# EAGLE schematic backplane-manual selection (EAGLE 6.6.0)
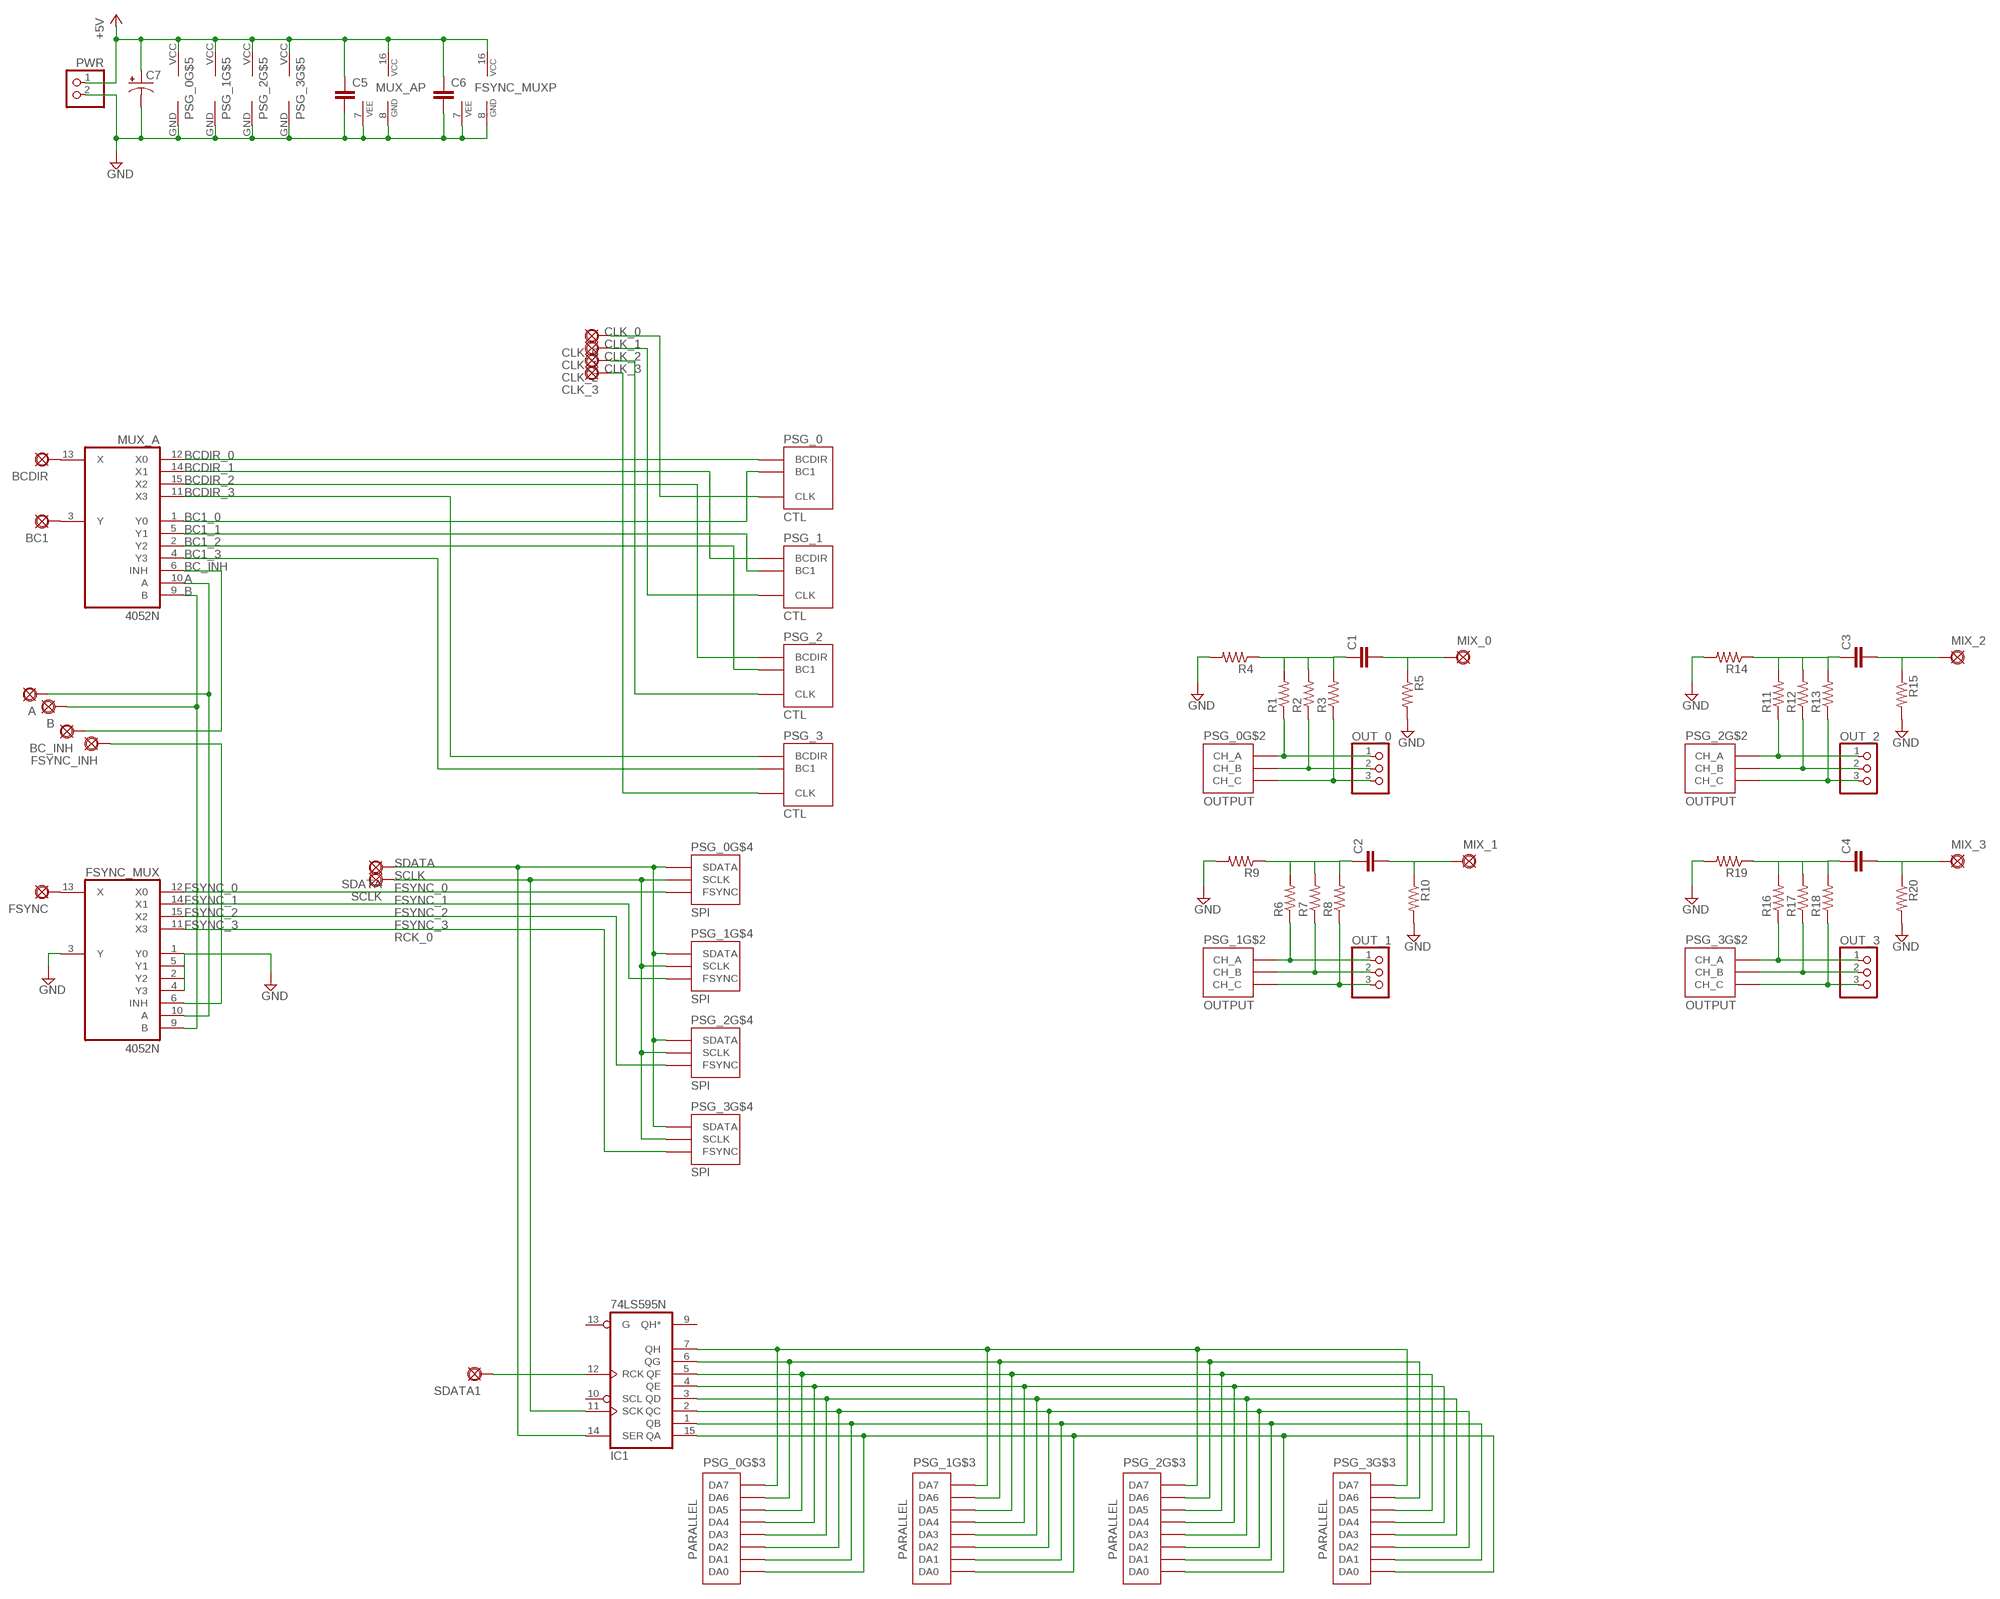
[diagram p0: schematic, sheet 1]

## Parts
A  PAD  [SQUARE]
B  PAD  [SQUARE]
BC1  PAD  [SQUARE]
BC_INH  PAD  [SQUARE]
BCDIR  PAD  [SQUARE]
C1  080X0452  [080X045]
C2  080X0452  [080X045]
C3  080X0452  [080X045]
C4  080X0452  [080X045]
C5  050X030_0251  [050X030_025]
C6  050X030_0251  [050X030_025]
C7  0631  [063_025]
CLK_0  PAD  [SQUARE]
CLK_1  PAD  [SQUARE]
CLK_2  PAD  [SQUARE]
CLK_3  PAD  [SQUARE]
FSYNC  PAD  [SQUARE]
FSYNC_INH  PAD  [SQUARE]
FSYNC_MUX  4052N  [DIL16]
IC1  74LS595N  [DIL16]
MIX_0  PAD  [SQUARE]
MIX_1  PAD  [SQUARE]
MIX_2  PAD  [SQUARE]
MIX_3  PAD  [SQUARE]
MUX_A  4052N  [DIL16]
OUT_0  PINHD-1X3  [1X03]
OUT_1  PINHD-1X3  [1X03]
OUT_2  PINHD-1X3  [1X03]
OUT_3  PINHD-1X3  [1X03]
PSG_0  PSG_DAUGHTER  [PSG_DAUGHTER]
PSG_1  PSG_DAUGHTER  [PSG_DAUGHTER]
PSG_2  PSG_DAUGHTER  [PSG_DAUGHTER]
PSG_3  PSG_DAUGHTER  [PSG_DAUGHTER]
PWR  PINHD-1X2  [1X02]
R1  6MM.3  [R0207/3]
R2  6MM.3  [R0207/3]
R3  6MM.3  [R0207/3]
R4  6MM.3  [R0207/3]
R5  6MM.3  [R0207/3]
R6  6MM.3  [R0207/3]
R7  6MM.3  [R0207/3]
R8  6MM.3  [R0207/3]
R9  6MM.3  [R0207/3]
R10  6MM.3  [R0207/3]
R11  6MM.3  [R0207/3]
R12  6MM.3  [R0207/3]
R13  6MM.3  [R0207/3]
R14  6MM.3  [R0207/3]
R15  6MM.3  [R0207/3]
R16  6MM.3  [R0207/3]
R17  6MM.3  [R0207/3]
R18  6MM.3  [R0207/3]
R19  6MM.3  [R0207/3]
R20  6MM.3  [R0207/3]
SCLK  PAD  [SQUARE]
SDATA  PAD  [SQUARE]
SDATA1  PAD  [SQUARE]

## Nets
+5V: C5.1 C6.1 C7.+ FSYNC_MUX.16(VCC) MUX_A.16(VCC) PSG_0.VCC PSG_1.VCC PSG_2.VCC PSG_3.VCC PWR.1
A: A.1(PAD) FSYNC_MUX.10(A) MUX_A.10(A)
B: B.1(PAD) FSYNC_MUX.9(B) MUX_A.9(B)
BC1_0: MUX_A.1(Y0) PSG_0.BC1
BC1_1: MUX_A.5(Y1) PSG_1.BC1
BC1_2: MUX_A.2(Y2) PSG_2.BC1
BC1_3: MUX_A.4(Y3) PSG_3.BC1
BC_INH: BC_INH.1(PAD) MUX_A.6(INH)
BCDIR_0: MUX_A.12(X0) PSG_0.BCDIR
BCDIR_1: MUX_A.14(X1) PSG_1.BCDIR
BCDIR_2: MUX_A.15(X2) PSG_2.BCDIR
BCDIR_3: MUX_A.11(X3) PSG_3.BCDIR
CLK_0: CLK_0.1(PAD) PSG_0.CLK
CLK_1: CLK_1.1(PAD) PSG_1.CLK
CLK_2: CLK_2.1(PAD) PSG_2.CLK
CLK_3: CLK_3.1(PAD) PSG_3.CLK
FSYNC: FSYNC.1(PAD) FSYNC_MUX.13(X)
FSYNC_0: FSYNC_MUX.12(X0) PSG_0.FSYNC
FSYNC_1: FSYNC_MUX.14(X1) PSG_1.FSYNC
FSYNC_2: FSYNC_MUX.15(X2) PSG_2.FSYNC
FSYNC_3: FSYNC_MUX.11(X3) PSG_3.FSYNC
FSYNC_INH: FSYNC_INH.1(PAD) FSYNC_MUX.6(INH)
GND: C5.2 C6.2 C7.- FSYNC_MUX.1(Y0) FSYNC_MUX.2(Y2) FSYNC_MUX.3(Y) FSYNC_MUX.4(Y3) FSYNC_MUX.5(Y1) FSYNC_MUX.7(VEE) FSYNC_MUX.8(GND) MUX_A.7(VEE) MUX_A.8(GND) PSG_0.GND PSG_1.GND PSG_2.GND PSG_3.GND PWR.2 R4.2 R5.2 R9.2 R10.2 R14.2 R15.2 R19.2 R20.2
N$1: C1.1 R1.2 R2.2 R3.2 R4.1
N$2: BCDIR.1(PAD) MUX_A.13(X)
N$3: BC1.1(PAD) MUX_A.3(Y)
N$5: C1.2 MIX_0.1(PAD) R5.1
N$8: C2.1 R6.2 R7.2 R8.2 R9.1
N$9: C2.2 MIX_1.1(PAD) R10.1
N$13: C3.1 R11.2 R12.2 R13.2 R14.1
N$14: C3.2 MIX_2.1(PAD) R15.1
N$16: IC1.7(QH) PSG_0.DA7 PSG_1.DA7 PSG_2.DA7 PSG_3.DA7
N$17: IC1.15(QA) PSG_0.DA0 PSG_1.DA0 PSG_2.DA0 PSG_3.DA0
N$18: IC1.1(QB) PSG_0.DA1 PSG_1.DA1 PSG_2.DA1 PSG_3.DA1
N$19: IC1.2(QC) PSG_0.DA2 PSG_1.DA2 PSG_2.DA2 PSG_3.DA2
N$20: IC1.3(QD) PSG_0.DA3 PSG_1.DA3 PSG_2.DA3 PSG_3.DA3
N$21: IC1.4(QE) PSG_0.DA4 PSG_1.DA4 PSG_2.DA4 PSG_3.DA4
N$22: IC1.5(QF) PSG_0.DA5 PSG_1.DA5 PSG_2.DA5 PSG_3.DA5
N$23: IC1.6(QG) PSG_0.DA6 PSG_1.DA6 PSG_2.DA6 PSG_3.DA6
N$24: OUT_0.1 PSG_0.OUT_A(CH_A) R1.1
N$25: OUT_0.2 PSG_0.OUT_B(CH_B) R2.1
N$26: OUT_0.3 PSG_0.OUT_C(CH_C) R3.1
N$27: OUT_1.1 PSG_1.OUT_A(CH_A) R6.1
N$28: OUT_1.2 PSG_1.OUT_B(CH_B) R7.1
N$29: OUT_1.3 PSG_1.OUT_C(CH_C) R8.1
N$30: OUT_2.1 PSG_2.OUT_A(CH_A) R11.1
N$31: OUT_2.2 PSG_2.OUT_B(CH_B) R12.1
N$32: OUT_2.3 PSG_2.OUT_C(CH_C) R13.1
N$33: OUT_3.1 PSG_3.OUT_A(CH_A) R16.1
N$34: OUT_3.2 PSG_3.OUT_B(CH_B) R17.1
N$35: OUT_3.3 PSG_3.OUT_C(CH_C) R18.1
N$38: C4.1 R16.2 R17.2 R18.2 R19.1
N$39: C4.2 MIX_3.1(PAD) R20.1
RCK_0: IC1.12(RCK) SDATA1.1(PAD)
SCLK: IC1.11(SCK) PSG_0.SCLK PSG_1.SCLK PSG_2.SCLK PSG_3.SCLK SCLK.1(PAD)
SDATA: IC1.14(SER) PSG_0.SDATA PSG_1.SDATA PSG_2.SDATA PSG_3.SDATA SDATA.1(PAD)
Unconnected: IC1.9(QH*) IC1.10(SCL) IC1.13(G)

## Power pins joined to a net without a drawn wire
GND: IC1.8(GND)
VCC: IC1.16(VCC)

## Library data of the parts
A B BC1 BC_INH BCDIR CLK_0 CLK_1-CLK_3 FSYNC FSYNC_INH MIX_0 MIX_1-MIX_3 SCLK SDATA SDATA1 = gm-supply:PAD: PAD use this package for pads with any purpose, including input, output, send or return various pad shapes: round, square, octogonal, long, and long offset
C1-C4 = gm-caps-film-chicklet:080X045: 0.056 - 0.082uF Panasonic ECQ-B 8mm x 4.5mm 50V: 0.056 - 0.082uF;
C5 C6 = gm-caps-ceramic:050X030_025: 47 - 120pF Xicon Ceramic Disc 2.5mm lead spacing
C7 = gm-caps-electro-pol:063: 33 - 220uF Xicon values at Mouser.com 10V: 220uF; 16V: 100uF; 25V: 100uF; 50V: 33uF
FSYNC_MUX MUX_A = 40xx:4052: Dual 4-channel ANALOG MULTIPLEXER
IC1 = 74xx-us:74*595: 8-bit SHIFT REGISTER, output latch
OUT_0 OUT_1-OUT_3 = pinhead:PINHD-1X3: PIN HEADER
PSG_0 PSG_1-PSG_3 = jaapie:PSG_DAUGHTER
PWR = pinhead:PINHD-1X2: PIN HEADER
R1-R20 = gm-resistors:6MM: 6mm Resistors Leads spaced 1-6 holes apart for 0.1" perfboard. Suitable for 1/4 watt resistors.